# Altium schematic sheet Power.SchDoc
size A4
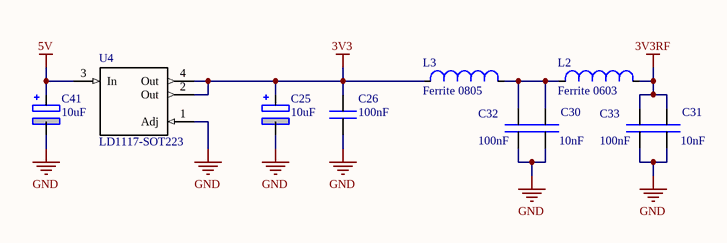
[diagram p0: Power.SchDoc]

## Parts
C25  10uF  [smd C1206 polar]
C26  100nF  [smd C0603_0.80]
C30  10nF  [smd C0402]
C31  10nF  [smd C0402]
C32  100nF  [smd C0603_0.80]
C33  100nF  [smd C0603_0.80]
C41  10uF  [smd C1206 polar]
L2  Ferrite 0603  [smd C0603]
L3  Ferrite 0805  [smd C0805]
U4  LD1117-SOT223  [SOT223]

## Nets
3V3: C25.1 C26.2 L3.1 U4.2(Out) U4.4(Out)
3V3RF: C31.2 C33.2 L2.2
5V: C41.1 U4.3(In)
GND: C25.2 C26.1 C30.1 C31.1 C32.1 C33.1 C41.2 U4.1(Adj)
NetC30_2: C30.2 C32.2 L2.1 L3.2

## Library data of the parts
C25 C41 = CSMD1206/10uF/10V: smd capaciteit, tantalium, verp.1206, 10uF/10V; Part Number: CSMD1206/10uF/10V; Component Kind: Standard; Component Type: Standard; Designator: CSMD1206/10uF/10V; Pin Count: 2; Supplier 1: Farnell
C26 C32 C33 = CSMD603/100nF: smd capaciteit, verp.0603, 100nF; Part Number: CSMD603/100nF; Component Kind: Standard; Component Type: Standard; Designator: CSMD603/100nF; Pin Count: 2; Supplier 1: Farnell
C30 C31 = CSMD402/100nF: smd capaciteit, verp.0402, 10nF; Part Number: CSMD402/100nF; Component Kind: Standard; Component Type: Standard; Designator: CSMD402/100nF; Pin Count: 2; Supplier 1: Farnell
L2 = Ferrite 0603: Ferrite bead, 0603 package; Supplier 1: Farnell
L3 = Ferrite 0805: Ferrite bead, 0805 package; Supplier 1: Farnell